# Altium schematic sheet BOARD.SchDoc
size A
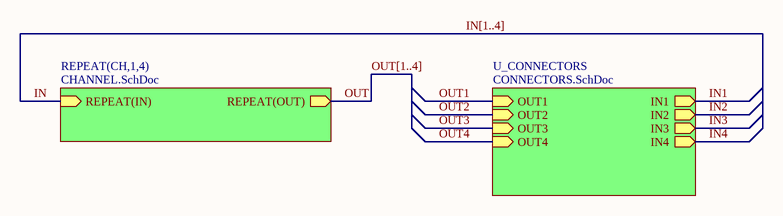
[diagram p0: BOARD.SchDoc]

## Sub-sheets
REPEAT(CH,1,4) = CHANNEL.SchDoc: REPEAT(IN) (in), REPEAT(OUT) (out)
U_CONNECTORS = CONNECTORS.SchDoc: IN1 (out), IN2 (out), IN3 (out), IN4 (out), OUT1 (in), OUT2 (in), OUT3 (in), OUT4 (in)

## Nets
IN: sheet REPEAT(CH,1,4)/REPEAT(IN)
IN1: sheet U_CONNECTORS/IN1
IN2: sheet U_CONNECTORS/IN2
IN3: sheet U_CONNECTORS/IN3
IN4: sheet U_CONNECTORS/IN4
OUT: sheet REPEAT(CH,1,4)/REPEAT(OUT)
OUT1: sheet U_CONNECTORS/OUT1
OUT2: sheet U_CONNECTORS/OUT2
OUT3: sheet U_CONNECTORS/OUT3
OUT4: sheet U_CONNECTORS/OUT4

## Buses and harness runs
bus IN[1..4]
bus OUT[1..4]